# Altium schematic sheet Circuito_part1_Altium.SchDoc
size A4
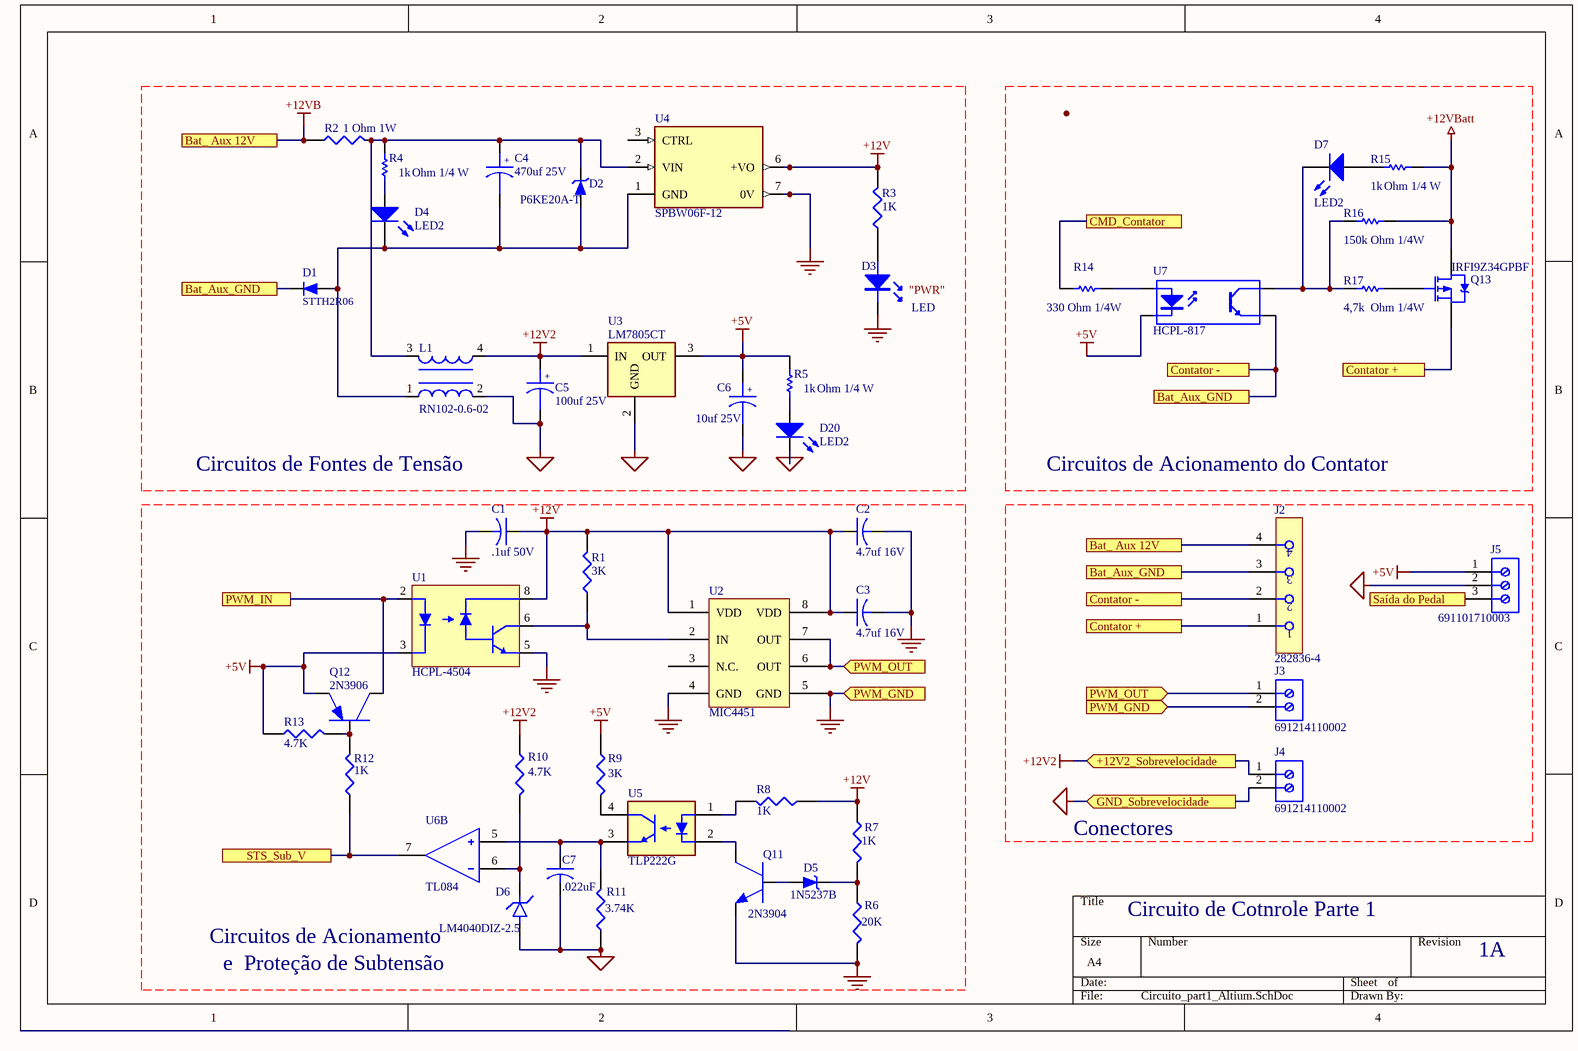
[diagram p0: Circuito_part1_Altium.SchDoc]

## Parts
C1  .1uf 50V  [RAD0.2]
C2  4.7uf 16V  [RAD0.2]
C3  4.7uf 16V  [RAD0.2]
C4  470uf 25V  [FC/10/5/0.6]
C5  100uf 25V  [RB.1/.25]
C6  10uf 25V  [RB.079/.2]
C7  .022uF  [RAD0.2]
D1  STTH2R06  [DIODE/AXIAL/11/3/0.9]
D2  P6KE20A-T  [DIODE/AXIAL/11/3/0.9]
D3  LED  [LUMEX SSL-LX5093]
D4  LED2  [3.2X1.6X1.1]
D5  1N5237B  [DIODE0.3]
D6  LM4040DIZ-2.5  [TO-92C1]
D7  LED2  [3.2X1.6X1.1]
D20  LED2  [3.2X1.6X1.1]
J2  282836-4  [FP-282836-4-MFG]
J3  691214110002  [691214110002]
J4  691214110002  [691214110002]
J5  691101710003  [691101710003]
L1  RN102-0.6-02  [RN102]
Q11  2N3904  [TO-92MY1]
Q12  2N3906  [TO-92MY1]
Q13  IRFI9Z34GPBF  [TO-220AB]
R1  3K  [AXIAL0.4]
R2  1 Ohm 1W  [AXIAL0.7]
R3  1K  [AXIAL0.4]
R4  Ohm 1/4 W  value 1k  [AXIAL-0.3]
R5  Ohm 1/4 W  value 1k  [AXIAL-0.3]
R6  20K  [AXIAL0.4]
R7  1K  [AXIAL0.4]
R8  1K  [AXIAL0.4]
R9  3K  [AXIAL0.4]
R10  4.7K  [AXIAL0.4]
R11  3.74K  [AXIAL0.4]
R12  1K  [AXIAL0.4]
R13  4.7K  [AXIAL0.4]
R14  value 330 Ohm 1/4W  [AXIAL-0.3]
R15  Ohm 1/4 W  value 1k  [AXIAL-0.3]
R16  Ohm 1/4W  value 150k  [AXIAL-0.3]
R17  Ohm 1/4W  value 4,7k  [AXIAL-0.3]
U1  HCPL-4504  [DIP8]
U2  MIC4451  [DIP8]
U3  LM7805CT  [TO-220-PAR-HS-MOUNT]
U4  SPBW06F-12  [CONV_PQQ6W-Q24-S12-S]
U5  TLP222G  [DIP4]
U6  TL084  [DIP8]  (part B of 2)
U7  HCPL-817  [DIP-4]

## Ports
+12V2_Sobrevelocidade (in), Bat_ Aux 12V, Bat_Aux_GND, CMD_Contator, Contator +, Contator -, GND_Sobrevelocidade (in), PWM_GND (in), PWM_IN, PWM_OUT (in), Saída do Pedal (in), STS_Sub_V

## Nets
3: D6.1
+5V: C6.1 J5.1 Q12.2(E) R5.1 R9.1 R13.1 U1.3(K) U3.3(OUT) U7.2(K)
+12V: C1.1 C2.1 C3.1 R1.2 R3.2 R7.1 R8.1 U1.8(VCC) U2.1(VDD) U2.8(VDD) U4.6(+VO)
+12V2: C5.1 J4.1 L1.4 R10.1 U3.1(IN) ; port +12V2_Sobrevelocidade
+12VB: J2.4 R2.1 ; port Bat_ Aux 12V
+12VBatt: Q13.2(D) R15.1 R16.2
PGND: C1.2 C2.2 C3.2 D3.K J3.2 Q11.2(E) R6.2 U1.5(GND) U2.4(GND) U2.5(GND) U4.7(0V) ; port PWM_GND
SGND: C5.2 C6.2 C7.2 D6.3(K) D20.2(K) J4.2 J5.2 L1.2 R11.1 U3.2(GND) ; port GND_Sobrevelocidade
Bat_Aux_GND: D1.2(K) J2.2 J2.3 U7.3(E) ; port Bat_Aux_GND, port Contator -
CMD_Contator: R14.1 ; port CMD_Contator
Contator +: J2.1 Q13.3(S) ; port Contator +
PWM_IN: Q12.3(C) U1.2(A) ; port PWM_IN
PWM_OUT: J3.1 U2.6(OUT) U2.7(OUT) ; port PWM_OUT
Saída do Pedal: J5.3 ; port Saída do Pedal
STS_Sub_V: R12.1 U6.7(VOB) ; port STS_Sub_V
NetC4_1: C4.1 D2.2(A) L1.3 R2.2 R4.1 U4.2(VIN)
NetC4_2: C4.2 D1.1(A) D2.1(K) D4.2(K) L1.1 U4.1(GND)
NetC7_1: C7.1 R11.2 U5.3(E1) U6.5(INB+)
NetD3_A: D3.A R3.1
NetD4_1: D4.1(A) R4.2
NetD5_1: D5.1(A) Q11.1(B)
NetD5_2: D5.2(K) R6.1 R7.2
NetD6_2: D6.2(A) R10.2 U6.6(INB-)
NetD7_1: D7.1(A) R15.2
NetD7_2: D7.2(K) R16.1 R17.1 U7.4(C)
NetD20_1: D20.1(A) R5.2
NetQ11_3: Q11.3(C) U5.2(K2)
NetQ12_1: Q12.1(B) R12.2 R13.2
NetQ13_1: Q13.1(G) R17.2
NetR1_1: R1.1 U1.6(VO) U2.2(IN)
NetR8_2: R8.2 U5.1(A1)
NetR9_2: R9.2 U5.4(C1)
NetR14_2: R14.2 U7.1(A)

Not connected (* = marked no-connect by the designer): U2 3(N.C.); U4 3(CTRL)

## Notes on the sheet
- (near D3) "PWR"
- Circuitos de Fontes de Tensão
- Circuitos de Acionamento do Contator
- Conectores
- Circuito de Cotnrole Parte 1
- Circuitos de Acionamento
- (near D6) e  Proteção de Subtensão
- 1A
- (in symbol CAPACITOR POL) +

## Library data of the parts
C1-C3 C7 = CAPACITOR
C4-C6 = CAPACITOR POL: Capacitor
D1 = MYDIODE
D2 = TRANSZORB-UNIDIRECTIONAL
D3 = MYLED
D4 = LED2: +12 V; Published: 8-Jun-2000; LatestRevisionDate: 17-Jul-2002; LatestRevisionNote: Re-released for DXP Platform.; PackageVersion: Feb-2002; PackageReference: 3.2X1.6X1.1; Publisher: Altium Limited; PackageDescription: SM LED; 2 Flat Leads
D5 = MYZENER
D7 D20 = LED2: +5 V; Published: 8-Jun-2000; LatestRevisionDate: 17-Jul-2002; LatestRevisionNote: Re-released for DXP Platform.; PackageVersion: Feb-2002; PackageReference: 3.2X1.6X1.1; Publisher: Altium Limited; PackageDescription: SM LED; 2 Flat Leads
J2 = CMP-03790-46505329-1: 282836-4 Connector, Terminal Block; Wire Receptacle; 4 Pos.; 16-30 AWG; 0.197 in. CL; Sid; Manufacturer Lifecycle Status: ACTIVE; Number of Contacts: 4; Max Supply Voltage (AC): 300V; Wire Gauge (Min): 30AWG; Max Current Rating: 13.5A; Approvals: UL; Number of Levels: 1; Thread Size: M3; Connector System: Wire-to-Board; Voltage Rating (DC): 250V; Pitch: 5mm; Plating: Brass; Tail Length: 3.5mm; Housing Color: Green; Number of Rows: 1; REACH SVHC: Unknown; Lead Pitch: 5mm; Depth: 8.2mm; Lead Free: Lead Free; Mount: Through Hole; Contact Plating: Tin; Housing Material: Polyamide; ELV: Compliant; Radiation Hardening: No; RoHS: Compliant; Number of Circuits: 4; Voltage Rating: 300V; Contact Material: Brass; NexarPartId: 46505329; Current Rating: 13.5A; Max Voltage Rating (AC): 300V; Orientation: Straight; Number of Positions: 4; Lifecycle Status: Production; Operating Supply Voltage: 300V; Connector Type: Receptacle; Number of Positions Per Level: 4; Flammability Rating: UL94 V-0; Packaging: Bulk; Termination: Screw, Solder; Wire Gauge (Max): 30AWG; Number of Poles: 4; Width: 10mm; Voltage Rating (AC): 250V; Length: 20mm; Current: 13.5A; Voltage: 300V; Color: Green
J3 J4 = CMP-1502-02464-2: NexarPartId: 18818288; Plating: Brass, Steel; Current: 10A; Pitch: 3.5052mm; Number of Levels: 1; Number of Contacts: 2; Wire Gauge (Min): 16AWG; Voltage: 300V; Wire Gauge (Max): 24AWG; Stripping Length: -6mm; Number of Pins: 2; Number of Rows: 1; REACH SVHC: Unknown; RoHS: Compliant; Housing Material: Nylon; Termination: Screw; Mount: Through Hole; Contact Plating: Brass, Tin; Number of Positions Per Level: 2; Color: Blue, Green; Width: 7.9mm; Voltage Rating: 300V; Length: 7.4mm; Current Rating: 10A; Wire/Cable Gauge: 24AWG; Packaging: Box; Max Operating Temperature: 105°C; Lead Pitch: 3.5mm; Height: 8.7mm; Contact Material: Brass; Min Operating Temperature: -40°C
J5 = CMP-1502-03257-2: NexarPartId: 8917705; Voltage Rating: 250V; Current: 16A; Wire Gauge (Min): 14AWG; Pitch: 5.0038mm; Wire Gauge (Max): 26AWG; Number of Positions Per Level: 3; Plating: Steel; Number of Levels: 1; Stripping Length: -7mm; REACH SVHC: Unknown; Width: 16.2mm; Height: 16.4mm; Contact Material: Brass; RoHS: Compliant; Color: Blue; Contact Plating: Tin; Lead Pitch: 5mm; Packaging: Box; Termination: Screw; Number of Contacts: 3; Wire/Cable Gauge: 26AWG; Min Operating Temperature: -40°C; Max Operating Temperature: 105°C; Housing Material: Nylon; Length: 9mm; Voltage: 250V; Mount: Through Hole; Current Rating: 16A; Number of Pins: 3
L1 = RN102-0.6-02: Common-Mode Choke
Q11 = NPN
Q12 = PNP
Q13 = PMOS-2: P-Channel Power MOSFET; Note: Pin 4 not drawn and electrically connected to Pin 2.; Published: 8-Jun-2000; LatestRevisionDate: 17-Jul-2002; LatestRevisionNote: Re-released for DXP Platform.; DatasheetVersion: PD-9.390D; PackageVersion: Feb-1997; PackageReference: TO-220AB; Publisher: Altium Limited; PackageDescription: TO, Thru-Hole, Vertical, Heatsink Mounted; 3 In-Line Leads; Pitch 2.54 mm; ComponentLink1Description: Manufacturer Link; ComponentLink1URL: http://www.irf.com/
R1-R3 R6-R13 = RES1
R4 R5 R14-R17 = Res1: Resistor; Published: 8-Jun-2000; LatestRevisionDate: 17-Jul-2002; LatestRevisionNote: Re-released for DXP Platform.; PackageReference: AXIAL-0.3; Publisher: Altium Limited; PackageDescription: Axial Device, Thru-Hole; 2 Leads; 0.3 in Pin Spacing
U1 = HCPL-4504: Optocoupler with high CMRR
U2 = MIC4451: FET Driver, 9A
U4 = PQQ6W-Q24-S12-S: DC-DC CONVERTER; MF: {'manufacturer': u'CUI'}; Price: None; Availability: Unavailable; Value: *; MP: PQQ6W-Q24-S12-S; Package: None
U5 = PS2501-1
U6 = LM393M
U7 = Optoisolator1: 4-Pin Phototransistor Optocoupler; Published: 24-Mar-1999; LatestRevisionDate: 04-Mar-2005; LatestRevisionNote: Sch pins 3 & 4 Swapped.; DatasheetVersion: Nov-2003; PackageReference: DIP-4; Publisher: Altium Limited